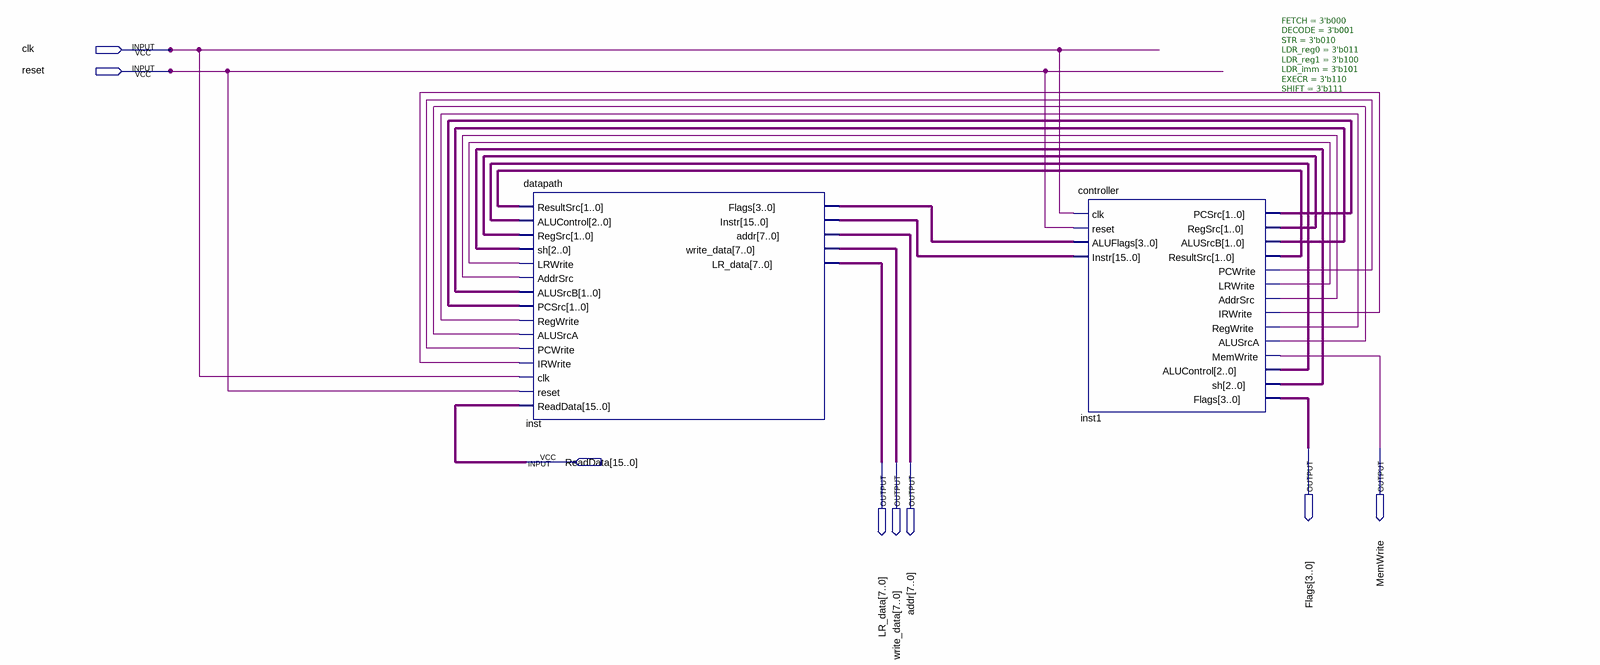
[diagram p0: schematic sheet]
// Quartus schematic processor.bdf as structural Verilog: 2 symbols, 8 pins
module processor (
  input  clk,
  input  reset,
  input  [15:0] ReadData,
  output [3:0] Flags,
  output MemWrite,
  output [7:0] LR_data,
  output [7:0] write_data,
  output [7:0] addr
);

  wire inst1_addrsrc, inst1_alusrca, inst1_irwrite, inst1_lrwrite, inst1_pcwrite, inst1_regwrite;
  wire [1:0] inst1_alusrcb, inst1_pcsrc, inst1_regsrc, inst1_resultsrc;
  wire [2:0] inst1_alucontrol, inst1_sh;
  wire [3:0] inst_flags;
  wire [15:0] inst_instr;

  datapath inst (
    .ResultSrc(inst1_resultsrc), .ALUControl(inst1_alucontrol), .RegSrc(inst1_regsrc), .sh(inst1_sh),
    .LRWrite(inst1_lrwrite), .AddrSrc(inst1_addrsrc), .ALUSrcB(inst1_alusrcb), .PCSrc(inst1_pcsrc),
    .RegWrite(inst1_regwrite), .ALUSrcA(inst1_alusrca), .PCWrite(inst1_pcwrite), .IRWrite(inst1_irwrite),
    .clk(clk), .reset(reset), .ReadData(ReadData), .Flags(inst_flags), .Instr(inst_instr), .addr(addr),
    .write_data(write_data), .LR_data(LR_data));
  controller #(.FETCH(3'b000), .DECODE(3'b001), .STR(3'b010), .LDR_reg0(3'b011), .LDR_reg1(3'b100), .LDR_imm(3'b101), .EXECR(3'b110), .SHIFT(3'b111)) inst1 (
    .clk(clk), .reset(reset), .ALUFlags(inst_flags), .Instr(inst_instr), .PCSrc(inst1_pcsrc),
    .RegSrc(inst1_regsrc), .ALUSrcB(inst1_alusrcb), .ResultSrc(inst1_resultsrc), .PCWrite(inst1_pcwrite),
    .LRWrite(inst1_lrwrite), .AddrSrc(inst1_addrsrc), .IRWrite(inst1_irwrite), .RegWrite(inst1_regwrite),
    .ALUSrcA(inst1_alusrca), .MemWrite(MemWrite), .ALUControl(inst1_alucontrol), .sh(inst1_sh), .Flags(Flags));
endmodule
